# Altium schematic sheet GasSensor.SchDoc
size A4
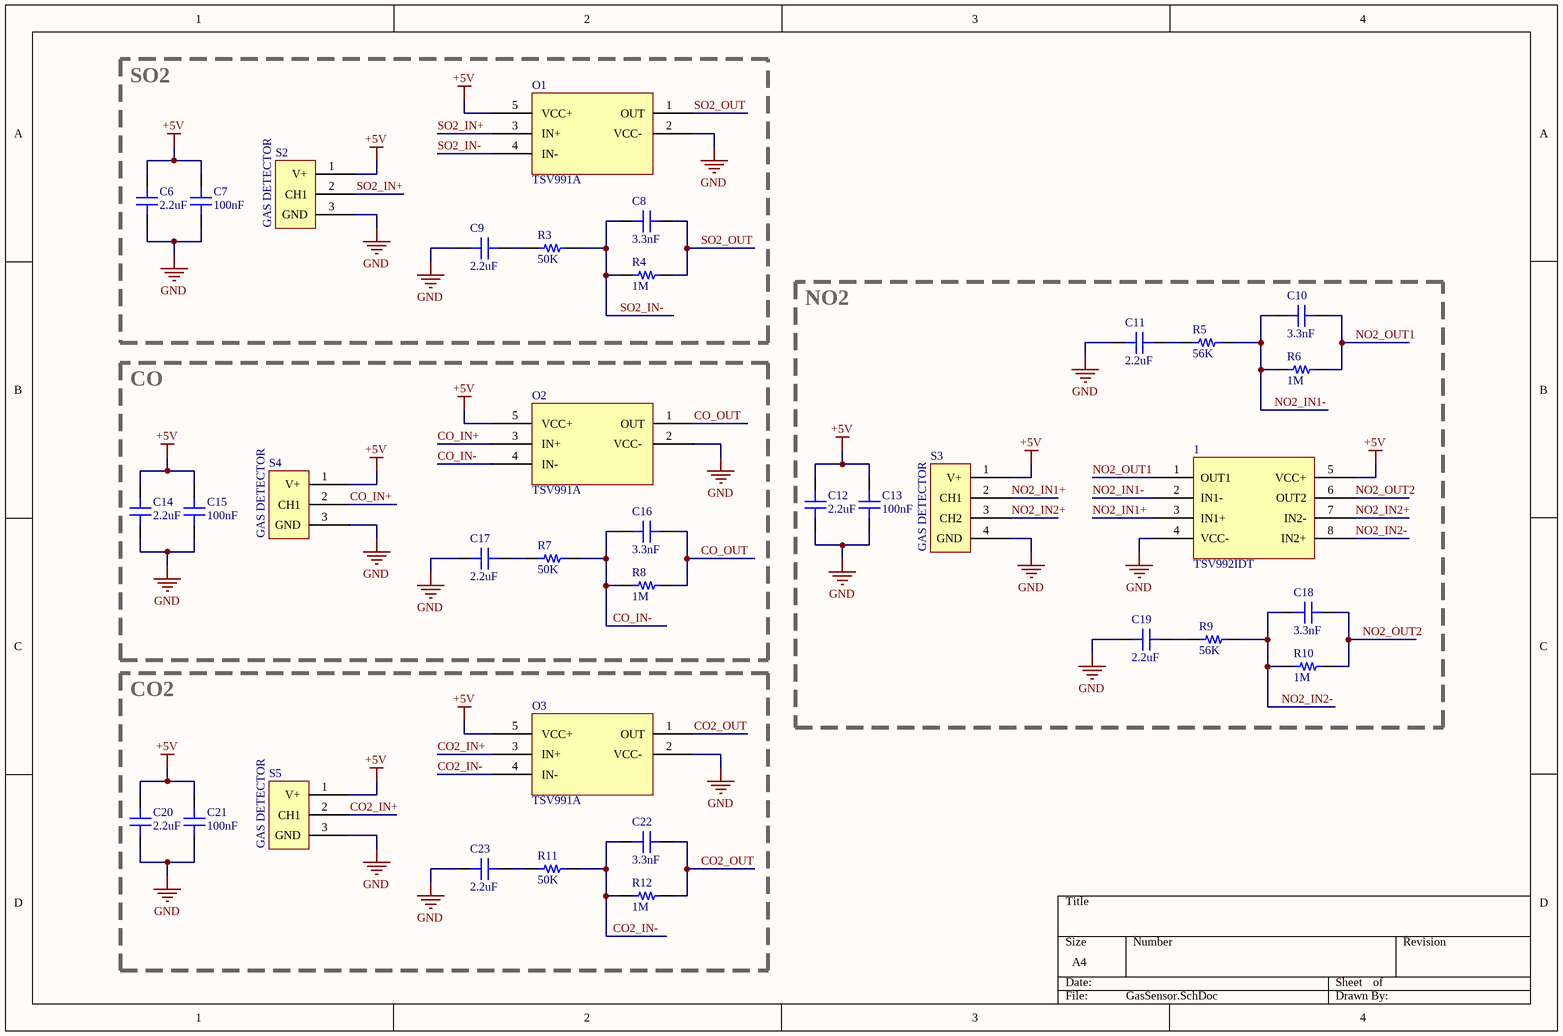
[diagram p0: GasSensor.SchDoc]

## Parts
1  TSV992IDT  [SOIC8]
C6  2.2uF  [CAP 0603_1608]
C7  100nF  [CAP 0603_1608]
C8  3.3nF  [CAP 0603_1608]
C9  2.2uF  [CAP 0603_1608]
C10  3.3nF  [CAP 0603_1608]
C11  2.2uF  [CAP 0603_1608]
C12  2.2uF  [CAP 0603_1608]
C13  100nF  [CAP 0603_1608]
C14  2.2uF  [CAP 0603_1608]
C15  100nF  [CAP 0603_1608]
C16  3.3nF  [CAP 0603_1608]
C17  2.2uF  [CAP 0603_1608]
C18  3.3nF  [CAP 0603_1608]
C19  2.2uF  [CAP 0603_1608]
C20  2.2uF  [CAP 0603_1608]
C21  100nF  [CAP 0603_1608]
C22  3.3nF  [CAP 0603_1608]
C23  2.2uF  [CAP 0603_1608]
O1  TSV991A  [SOT23-5]
O2  TSV991A  [SOT23-5]
O3  TSV991A  [SOT23-5]
R3  50K  [RES 0603_1608]
R4  1M  [RES 0603_1608]
R5  56K  [RES 0603_1608]
R6  1M  [RES 0603_1608]
R7  50K  [RES 0603_1608]
R8  1M  [RES 0603_1608]
R9  56K  [RES 0603_1608]
R10  1M  [RES 0603_1608]
R11  50K  [RES 0603_1608]
R12  1M  [RES 0603_1608]
S2  GAS DETECTOR  [TO-39 CIRCLE]
S3  GAS DETECTOR  [TO-39 DUAL]
S4  GAS DETECTOR  [TO-39 CIRCLE]
S5  GAS DETECTOR  [TO-39 CIRCLE]

## Blocks framed on the sheet
SO2: C6-C9 O1 R3 R4 S2
NO2: 1 C10-C13 C18 C19 R5 R6 R9 R10 S3
CO: C14-C17 O2 R7 R8 S4
CO2: C20-C23 O3 R11 R12 S5

## Nets
+5V: 1.5(VCC+) C6.1 C7.2 C12.1 C13.2 C14.1 C15.2 C20.1 C21.2 O1.5(VCC+) O2.5(VCC+) O3.5(VCC+) S2.1(V+) S3.1(V+) S4.1(V+) S5.1(V+)
GND: 1.4(VCC-) C6.2 C7.1 C9.1 C11.1 C12.2 C13.1 C14.2 C15.1 C17.1 C19.1 C20.2 C21.1 C23.1 O1.2(VCC-) O2.2(VCC-) O3.2(VCC-) S2.3(GND) S3.4(GND) S4.3(GND) S5.3(GND)
CO2_IN+: O3.3(IN+) S5.2(CH1)
CO2_IN-: C22.1 O3.4(IN-) R11.2 R12.1
CO2_OUT: C22.2 O3.1(OUT) R12.2
CO_IN+: O2.3(IN+) S4.2(CH1)
CO_IN-: C16.1 O2.4(IN-) R7.2 R8.1
CO_OUT: C16.2 O2.1(OUT) R8.2
NO2_IN1+: 1.3(IN1+) S3.2(CH1)
NO2_IN1-: 1.2(IN1-) C10.1 R5.2 R6.1
NO2_IN2+: 1.7(IN2-) S3.3(CH2)
NO2_IN2-: 1.8(IN2+) C18.1 R9.2 R10.1
NO2_OUT1: 1.1(OUT1) C10.2 R6.2
NO2_OUT2: 1.6(OUT2) C18.2 R10.2
SO2_IN+: O1.3(IN+) S2.2(CH1)
SO2_IN-: C8.1 O1.4(IN-) R3.2 R4.1
SO2_OUT: C8.2 O1.1(OUT) R4.2
NetC9_2: C9.2 R3.1
NetC11_2: C11.2 R5.1
NetC17_2: C17.2 R7.1
NetC19_2: C19.2 R9.1
NetC23_2: C23.2 R11.1

## Library data of the parts
1 = TSV992IDT: Operational Amplifiers Op Amps SOIC-8 2 Channel 20 MHz; ComponentLink1Description: Digi-Key; ComponentLink1URL: https://www.digikey.com/en/products/detail/stmicroelectronics/TSV992IDT/1578406
C6 C9 C11 C12 C14 C17 C19 C20 C23 = 2.2uF: CERAMİC 1206 SMD
C7 C13 C15 C21 = 100nF: CERAMİC 1206 SMD
C8 C10 C16 C18 C22 = 3.3nF: CERAMİC 1206 SMD
O1-O3 = TSV991A: Operational Amplifiers Op Amps SOT23-5 1 Channel 20 MHz; ComponentLink1Description: Mouser; ComponentLink1URL: https://www.mouser.com.tr/ProductDetail/STMicroelectronics/TSV991AILT?qs=NCG0bTVqH4ejiP6AM1B8jw%3D%3D
R3 R7 R11 = 50K: SMT RES 1206
R4 R6 R8 R10 R12 = 1M: SMT RES 1206
R5 R9 = 56K: SMT RES 1206
S2 S4 S5 = QGC Circle Sensor: GAS DETECTOR, ANALOG TO-39, GAS
S3 = QGC Dual Sensor: GAS DETECTOR, ANALOG TO-39, GAS